# Altium schematic sheet USB-interface.SchDoc: USB-interface
size A4; Engineer: CT; SheetNumber: 2; SheetTotal: 3
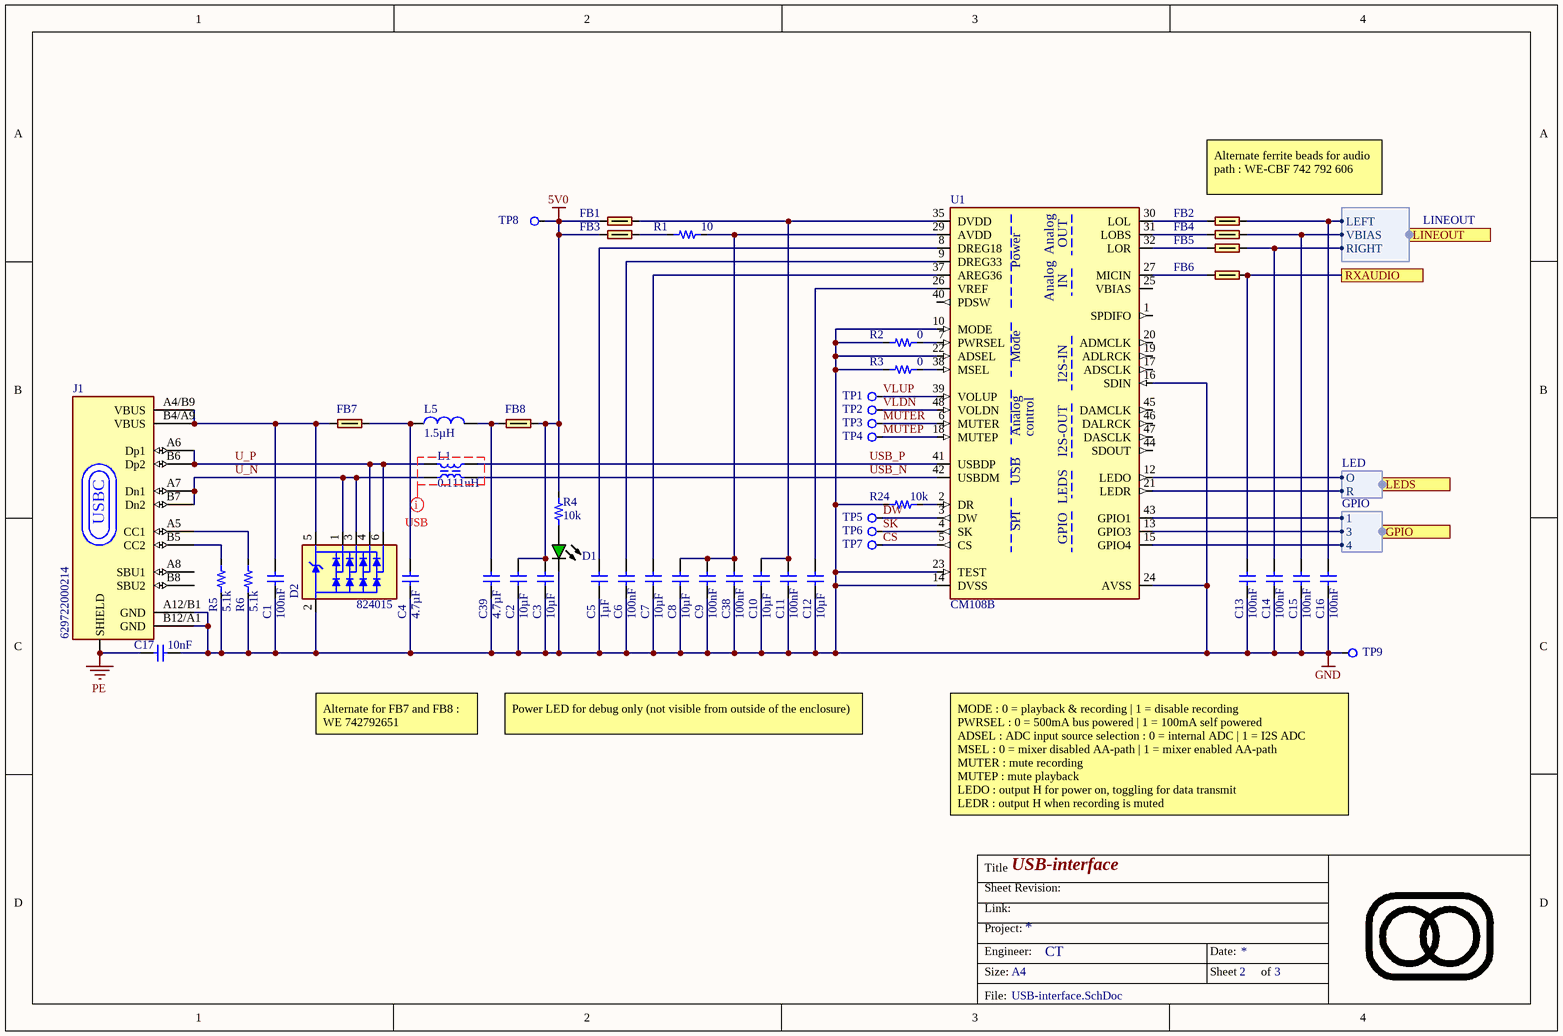
[diagram p0: USB-interface.SchDoc]

## Parts
C1  value 100nF  [0603-C-N]  (hidden comment: alternative Capacitor 100nF +/-10% 50V X7R 0603)
C2  value 10µF  [WCAP-CSGP_1210_L3.2W2.5H2.5]  (hidden comment: Capacitor 10µF +/-10% 50V X7R 1210)
C3  value 10µF  [WCAP-CSGP_1210_L3.2W2.5H2.5]  (hidden comment: Capacitor 10µF +/-10% 50V X7R 1210)
C4  value 4.7µF  [1206-C-N]  (hidden comment: Capacitor 4.7µF +/-10% 10V X7R 1206)
C5  value 1µF  [0603-C-N]  (hidden comment: Capacitor 1µF +/-10% 16V X7R 0603)
C6  value 100nF  [0603-C-N]  (hidden comment: alternative Capacitor 100nF +/-10% 50V X7R 0603)
C7  value 10µF  [WCAP-CSGP_1210_L3.2W2.5H2.5]  (hidden comment: Capacitor 10µF +/-10% 50V X7R 1210)
C8  value 10µF  [WCAP-CSGP_1210_L3.2W2.5H2.5]  (hidden comment: Capacitor 10µF +/-10% 50V X7R 1210)
C9  value 100nF  [0603-C-N]  (hidden comment: alternative Capacitor 100nF +/-10% 50V X7R 0603)
C10  value 10µF  [WCAP-CSGP_1210_L3.2W2.5H2.5]  (hidden comment: Capacitor 10µF +/-10% 50V X7R 1210)
C11  value 100nF  [0603-C-N]  (hidden comment: alternative Capacitor 100nF +/-10% 50V X7R 0603)
C12  value 10µF  [WCAP-CSGP_1210_L3.2W2.5H2.5]  (hidden comment: Capacitor 10µF +/-10% 50V X7R 1210)
C13  value 100nF  [0603-C-N]  (hidden comment: alternative Capacitor 100nF +/-10% 50V X7R 0603)
C14  value 100nF  [0603-C-N]  (hidden comment: alternative Capacitor 100nF +/-10% 50V X7R 0603)
C15  value 100nF  [0603-C-N]  (hidden comment: alternative Capacitor 100nF +/-10% 50V X7R 0603)
C16  value 100nF  [0603-C-N]  (hidden comment: alternative Capacitor 100nF +/-10% 50V X7R 0603)
C17  value 10nF  [0603-C-N]  (hidden comment: Capacitor 10nF 50V NP0 0603)
C38  value 100nF  [0603-C-N]  (hidden comment: alternative Capacitor 100nF +/-10% 50V X7R 0603)
C39  value 4.7µF  [1206-C-N]  (hidden comment: Capacitor 4.7µF +/-10% 10V X7R 1206)
D1  150060GS84000  [WL-SMCW_0603_150060xx8x000]  (value not drawn)
D2  824015  [SOT-23-6]
FB1  742792662  [0603-FB-N]  (value not drawn)
FB2  742792662  [0603-FB-N]  (value not drawn)
FB3  742792662  [0603-FB-N]  (value not drawn)
FB4  742792662  [0603-FB-N]  (value not drawn)
FB5  742792662  [0603-FB-N]  (value not drawn)
FB6  742792662  [0603-FB-N]  (value not drawn)
FB7  74279221111  [WE-CBF_1206_Medium Current]  (value not drawn)
FB8  74279221111  [WE-CBF_1206_Medium Current]  (value not drawn)
J1  629722000214  [629722000214]
L1  Inductance: 0.111uH  [WE-CNSW_1206]  (hidden comment: 744232090)
L5  value 1.5µH  [WE-MAPI_2512]  (hidden comment: 74438324015)
R1  value 10  [0603-R-N]  (hidden comment: Resistor 10R +/-1% 50V 0603)
R2  value 0  [0603-R-N]  (hidden comment: Jumper 0R <50 mOhm 1A 0603)
R3  value 0  [0603-R-N]  (hidden comment: Jumper 0R <50 mOhm 1A 0603)
R4  value 10k  [0603-R-N]  (hidden comment: Resistor 10k +/-1% 50V 0603)
R5  value 5.1k  [0603-R-N]  (hidden comment: Resistor 5.1k +/-1% 50V 0603)
R6  value 5.1k  [0603-R-N]  (hidden comment: Resistor 5.1k +/-1% 50V 0603)
R24  value 10k  [0603-R-N]  (hidden comment: Resistor 10k +/-1% 50V 0603)
TP1  Testpad with multiple sizes  [TP_1.5mm_0.3mmHole]  (value not drawn)  (no BOM)
TP2  Testpad with multiple sizes  [TP_1.5mm_0.3mmHole]  (value not drawn)  (no BOM)
TP3  Testpad with multiple sizes  [TP_1.5mm_0.3mmHole]  (value not drawn)  (no BOM)
TP4  Testpad with multiple sizes  [TP_1.5mm_0.3mmHole]  (value not drawn)  (no BOM)
TP5  Testpad with multiple sizes  [TP_1.5mm_0.3mmHole]  (value not drawn)  (no BOM)
TP6  Testpad with multiple sizes  [TP_1.5mm_0.3mmHole]  (value not drawn)  (no BOM)
TP7  Testpad with multiple sizes  [TP_1.5mm_0.3mmHole]  (value not drawn)  (no BOM)
TP8  Testpad with multiple sizes  [TP_1.5mm_0.3mmHole]  (value not drawn)  (no BOM)
TP9  Testpad with multiple sizes  [TP_1.5mm_0.3mmHole]  (value not drawn)  (no BOM)
U1  CM108B  [TSQFP50P900X900X160-48N]

## Ports
GPIO (harness GPIO), LEDS (harness LED), LINEOUT (harness LINEOUT), RXAUDIO

## Harnesses
LINEOUT: LEFT, VBIAS, RIGHT
LED: O, R
GPIO: 1, 3, 4

## Nets
5V0: C2.2 C3.2 FB1.1 FB3.1 FB8.2 R4.2 TP8.1(Pad)
GND: C1.1 C2.1 C3.1 C4.1 C5.1 C6.1 C7.1 C8.1 C9.1 C10.1 C11.1 C12.1 C13.2 C14.2 C15.2 C16.2 C17.2 C38.1 C39.1 D1.1(K) D2.2 J1.A12/B1(GND) J1.B12/A1(GND) R2.1 R3.1 R5.1 R6.1 R24.2 TP9.1(Pad) U1.10(MODE) U1.14(DVSS) U1.16(SDIN) U1.22(ADSEL) U1.23(TEST) U1.24(AVSS)
PE: C17.1 J1.MNT(SHIELD)
CS: TP7.1(Pad) U1.5(CS)
DW: TP5.1(Pad) U1.3(DW)
MUTEP: TP4.1(Pad) U1.18(MUTEP)
MUTER: TP3.1(Pad) U1.6(MUTER)
RXAUDIO: C13.1 FB6.2 ; port RXAUDIO
SK: TP6.1(Pad) U1.4(SK)
U_N: D2.1 D2.3 J1.A7(Dn1) J1.B7(Dn2) L1.4
U_P: D2.4 D2.6 J1.A6(Dp1) J1.B6(Dp2) L1.1
USB_N: L1.3 U1.42(USBDM)
USB_P: L1.2 U1.41(USBDP)
VLDN: TP2.1(Pad) U1.48(VOLDN)
VLUP: TP1.1(Pad) U1.39(VOLUP)
NetC1_2: C1.2 D2.5 FB7.1 J1.A4/B9(VBUS) J1.B4/A9(VBUS)
NetC4_2: C4.2 FB7.2 L5.1
NetC5_2: C5.2 U1.8(DREG18)
NetC6_2: C6.2 U1.9(DREG33)
NetC7_2: C7.2 U1.37(AREG36)
NetC8_2: C8.2 C9.2 C38.2 R1.2 U1.29(AVDD)
NetC10_2: C10.2 C11.2 FB1.2 U1.35(DVDD)
NetC12_2: C12.2 U1.26(VREF)
NetC14_1: C14.1 FB5.2 ; port LINEOUT.RIGHT
NetC15_1: C15.1 FB4.2 ; port LINEOUT.VBIAS
NetC16_1: C16.1 FB2.2 ; port LINEOUT.LEFT
NetC39_2: C39.2 FB8.1 L5.2
NetD1_2: D1.2(A) R4.1
NetFB2_1: FB2.1 U1.30(LOL)
NetFB3_2: FB3.2 R1.1
NetFB4_1: FB4.1 U1.31(LOBS)
NetFB5_1: FB5.1 U1.32(LOR)
NetFB6_1: FB6.1 U1.27(MICIN)
NetJ1_A5: J1.A5(CC1) R6.2
NetJ1_B5: J1.B5(CC2) R5.2
NetR2_2: R2.2 U1.7(PWRSEL)
NetR3_2: R3.2 U1.38(MSEL)
NetR24_1: R24.1 U1.2(DR)
NetU1_12: U1.12(LEDO) ; port LEDS.O
NetU1_13: U1.13(GPIO3) ; port GPIO.3
NetU1_15: U1.15(GPIO4) ; port GPIO.4
NetU1_21: U1.21(LEDR) ; port LEDS.R
NetU1_43: U1.43(GPIO1) ; port GPIO.1

Not connected (* = marked no-connect by the designer): J1 A8(SBU1) B8(SBU2); U1 1(SPDIFO) 17(ADSCLK) 19(ADLRCK) 20(ADMCLK) 25(VBIAS) 40(PDSW) 44(SDOUT) 45(DAMCLK) 46(DALRCK) 47(DASCLK)

## Layout directives
differential pair: (no net found under the mark)

## Notes on the sheet
- Alternate ferrite beads for audio path : WE-CBF 742 792 606
- Alternate for FB7 and FB8 : WE 742792651
- Power LED for debug only (not visible from outside of the enclosure)
- (near TP9) MODE : 0 = playback & recording | 1 = disable recording
  PWRSEL : 0 = 500mA bus powered | 1 = 100mA self powered
  ADSEL : ADC input source selection : 0 = internal ADC | 1 = I2S ADC
  MSEL : 0 = mixer disabled AA-path | 1 = mixer enabled AA-path
  MUTER : mute recording
  MUTEP : mute playback
  LEDO : output H for power on, toggling for data transmit
  LEDR : output H when recording is muted
- Title
- Sheet Revision:
- Link:
- Size:
- Project:
- Engineer:
- A4
- Date:
- Sheet
- of
- File:
- (in symbol CMP-015-00044-4) OUT; Analog; Power; IN; Mode; I2S-IN; control; I2S-OUT; USB; LEDS; SPI; GPIO
- (in symbol CMP-088-000027-14) USBC

## Library data of the parts
C1 C6 C9 C11 C38 = CMP-072-000619-17: WCAP-CSGP Multilayer Ceramic Chip Capacitor, General Purpose, size 0603, X7R, 100nF, 50VDC; Dissipation Factor: 3%; Tolerance: 10%; Capacitor Type: MLCC; Insulation Resistance: 5GO; Technical Reference: X7R0603104K050DFCT10000; ComponentLink2Description: Datasheet Link; Dielectric: X7R; ComponentLink2URL: https://www.we-online.com/redexpert/spec/885012206095?ad; Case/Package: 0603; Voltage Rating: 50V; Height: 0.8mm; JLCPCB Part #: C14663; Design Item ID: 885012206095; Pins: 2; Min Operating Temperature: -55°C; Max Operating Temperature: 125°C; Width: 0.8mm; ComponentLink1URL: https://www.we-online.com/redexpert/article/885012206095?ad; Match Code: WCAP-CSGP; Packaging: Tape and Reel; Source: WCAP-CSGP.SchLib; Usage: General Purpose; Length: 1.6mm; ComponentLink1Description: Website Link; Mounting Technology: SMT
C2 C3 C7 C8 C10 C12 = CMP-072-000922-16: WCAP-CSGP Multilayer Ceramic Chip Capacitor, General Purpose, size 1210, X7R, 10µF, 50VDC; Tolerance: 10%; Technical Reference: X7R1210106K050DFCT10000; Insulation Resistance: 0.01GO; Capacitor Type: MLCC; ComponentLink2URL: https://www.we-online.com/redexpert/spec/885012209073?ad; ComponentLink1URL: https://www.we-online.com/redexpert/article/885012209073?ad; Source: WCAP-CSGP.SchLib; Case/Package: 1210; Packaging: Tape and Reel; ComponentLink1Description: Website Link; Pins: 2; Width: 2.5mm; Voltage Rating: 50V; ComponentLink2Description: Datasheet Link; Match Code: WCAP-CSGP; Max Operating Temperature: 125°C; Usage: General Purpose; JLCPCB Part #: C77102; Height: 2.5mm; Dielectric: X7R; Dissipation Factor: 10%; Length: 3.2mm; Min Operating Temperature: -55°C; Design Item ID: 885012209073; Mounting Technology: SMT
C4 C39 = CMP-072-000776-16: WCAP-CSGP Multilayer Ceramic Chip Capacitor, General Purpose, size 1206, X7R, 4.7µF, 10VDC; Dissipation Factor: 10%; Capacitor Type: MLCC; Insulation Resistance: 0.02GO; Technical Reference: X7R1206475K010DFCT10000; ComponentLink2Description: Datasheet Link; Dielectric: X7R; ComponentLink2URL: https://www.we-online.com/redexpert/spec/885012208017?ad; Case/Package: 1206; Voltage Rating: 10V; Height: 1.6mm; Tolerance: 10%; Design Item ID: 885012208017; Pins: 2; Min Operating Temperature: -55°C; Max Operating Temperature: 125°C; Width: 1.6mm; ComponentLink1URL: https://www.we-online.com/redexpert/article/885012208017?ad; Match Code: WCAP-CSGP; Packaging: Tape and Reel; Source: WCAP-CSGP.SchLib; Usage: General Purpose; Length: 3.2mm; ComponentLink1Description: Website Link; Mounting Technology: SMT; JLCPCB Basic Part: Yes; JLCPCB Part #: C29823
C5 = CMP-001-00004-22: Capacitor MLCC, General Purpose, size 0603, X7R, 1µF, +/-10%, 16V; Tolerance: 10%; Mounting Technology: SMT; Usage: General Purpose; Case/Package: 0603; Max Operating Temperature: 125°C; JLCPCB Part #: C15849; Dielectric: X7R; RoHS Compliant: True; Height: 0.8mm; Width: 0.8mm; Capacitor Type: MLCC; Voltage Rating: 16V; Length: 1.6mm; Pins: 2; Min Operating Temperature: -55°C
C13-C16 = CMP-072-000619-17: WCAP-CSGP Multilayer Ceramic Chip Capacitor, General Purpose, size 0603, X7R, 100nF, 50VDC; Tolerance: 10%; Dissipation Factor: 3%; Capacitor Type: MLCC; Insulation Resistance: 5GO; Technical Reference: X7R0603104K050DFCT10000; Case/Package: 0603; Width: 0.8mm; Min Operating Temperature: -55°C; Mounting Technology: SMT; Dielectric: X7R; Packaging: Tape and Reel; Max Operating Temperature: 125°C; Voltage Rating: 50V; Height: 0.8mm; Length: 1.6mm; JLCPCB Part #: C14663; ComponentLink2Description: Datasheet Link; ComponentLink2URL: https://www.we-online.com/redexpert/spec/885012206095?ad; Design Item ID: 885012206095; Pins: 2; ComponentLink1URL: https://www.we-online.com/redexpert/article/885012206095?ad; Match Code: WCAP-CSGP; Source: WCAP-CSGP.SchLib; Usage: General Purpose; ComponentLink1Description: Website Link
C17 = CMP-001-00137-7: Multilayer Ceramic Capacitor, Grm Series, 0.01 F, 5%, C0g / Np0, 50 V, 0603 [1608 Metric]; FLIR Part #: YCAM10N-7; Page Part #: CCQJ103T; Temperature Coefficient: 30ppm/°C; Reach SVHC Compliant: No; Case/Package: 0603; Thickness: 0.035inch; Width: 0.8mm; Case Code (Metric): 1608; Termination: SMD/SMT; Min Operating Temperature: -55°C; Voltage Rating (DC): 50V; Mounting Technology: Surface Mount; Package Quantity: 4000; Depth: 0.8mm; Dielectric: C0G; Packaging: Cut Tape; Voltage: 50V; Max Operating Temperature: 125°C; RoHS Compliant: Yes; Material: Ceramic; Lead Pitch: 0.5mm; Case Code (Imperial): 0603; Tolerance: 5%; Voltage Rating: 50V; Lead Free: Lead Free; Height: 0.8mm; Length: 1.6mm; JLCPCB Part #: C85973; Series: GRM
D1 = CMP-002-001076-16: WL-SMCW Mono-color Chip LED Waterclear, size 0603, Green, 3.3V, 40°; Manufacturer: Wurth Elektronik; Page Part #: MOVPA-0270A; Chip Technology: InGaN; Case/Size Code: 0603; Luminous Intensity: 3000mcd; Peak Wavelength: 520nm; Dominant Wavelength: 525nm; Mount: Surface Mount; Design Item ID: 150060GS84000; Category: Signal LEDs; Component Type: Standard; Emitting Color: Green; Viewing Angle: 40°; Height: 0.95mm; Width: 0.8mm; Length: 1.6mm; JLCPCB Part #: C7429914; Packaging: Tape and Reel; Match Code: WL-SMCW; ComponentLink2Description: Datasheet Link; Forward Voltage: 3.3V; ComponentLink1Description: Website Link; ComponentLink2URL: https://www.we-online.com/redexpert/spec/150060GS84000?ad; Source: WL-SMCW.SchLib; Operating Temperature Max: 85°C; Manufacturer Part Number: 150060GS84000; Pin Count: 2; Operating Temperature Min: -40°C; ComponentLink1URL: https://www.we-online.com/redexpert/article/150060GS84000?ad
D2 = CMP-034-000015-16: WE-TVS TVS Diode - High Speed Series, SOT23-6L, 4+1Channel, 5Vdc; FLIR Part #: YDITA20KV100A; Manufacturer Part Number: SP3051; Manufacturer: Wurth Elektronik; Page Part #: D824015; Reverse Channel Leakage Current: 2uA; Reverse Breakdown Voltage min.: 6.1V; Reverse Peak Pulse Current: 12A; Channel: 4+1; DC Operating Voltage: 5V; Channel Input Capacitance: 2pF; Pin Count: 6; Packaging: Tape and Reel; Source: WE-TVS.SchLib; ComponentLink1Description: Manufacturer; ComponentLink2Description: Datasheet; Mounting Technology: SMT; JLCPCB Part #: C558418; Operating Temperature: -40 to +125degC; Published Date: April 2020; Size: SOT23-6L; ComponentLink2URL: https://www.we-online.com/catalog/datasheet/824015.pdf; Design Item ID: 824015; Component Type: Standard; ComponentLink1URL: http://www.we-online.de
FB1-FB6 = CMP-066-000126-8: WE-CBF SMT EMI Suppression Ferrite Bead, size 0603, 1000O, 0.83A; Manufacturer: Wurth Elektronik; Page Part #: FILTER279; Case/Size Code: 0603; Impedance Max Test Condition: 120MHz; Type: Wide Band; DC Resistance Max: 0.3O; Impedance Max: 1050O; Rated Current: 0.6A; Mount: Surface Mount; Impedance @100MHz: 1000O; JLCPCB Part #: C180490; ComponentLink1URL: https://www.we-online.com/redexpert/article/742792662?ad; ComponentLink2URL: https://www.we-online.com/redexpert/spec/742792662?ad; Length: 1.6mm; ComponentLink1Description: Website Link; Manufacturer Part Number: 742792662; Width: 0.8mm; Match Code: WE-CBF; Component Type: Standard; Design Item ID: 742792662; Pin Count: 2; Operating Temperature Max: 125°C; Packaging: Tape and Reel; ComponentLink2Description: Datasheet Link; Operating Temperature Min: -55°C; Category: Ferrites for PCB Assembly; Height: 0.8mm
FB7 FB8 = CMP-006-00032-6: Ferrite Beads Multi-Layer High Current 110Ohm 25% 100MHz 5.4A 0.015Ohm DCR 1206 T/R; Manufacturer: Wurth Elektronik; Impedance @100MHz: 120O; Case/Size Code: 1206; Impedance Max Test Condition: 500MHz; Match Code: WE-CBF; DC Resistance Max: 0.03O; Impedance Max: 180O; Rated Current: 3A; Mount: Surface Mount; JLCPCB Part #: C85841; ComponentLink1URL: https://www.we-online.com/redexpert/article/742792113?ad; ComponentLink2URL: https://www.we-online.com/redexpert/spec/742792113?ad; Length: 0.126inch; Type: High Current; ComponentLink1Description: Website Link; Width: 1.6mm; Component Type: Standard; Pin Count: 2; Operating Temperature Max: 125°C; Packaging: Tape and Reel; ComponentLink2Description: Datasheet Link; Operating Temperature Min: -55°C; Category: Ferrites for PCB Assembly; Height: 0.051inch; Source: WE-CBF.SchLib
J1 = CMP-088-000027-14: WR-USB 2.0 Type C, Receptacle, Horizontal, SMT; pin to pad: MNT>S1+S2+S3+S4; Manufacturer: Wurth Elektronik; Page Part #: K629722000214; Number of Ports: 1; Working Voltage: 20VAC; Interface Type: Type C; Rated Current: 5A; Category: Input/Output Connectors; ComponentLink1Description: Website Link; Orientation: Horizontal; ComponentLink1URL: https://www.we-online.com/redexpert/article/629722000214?ad; Pin Count: 13; Manufacturer Part Number: 629722000214; ComponentLink2Description: Datasheet Link; Gender: Receptacle; Match Code: WR-USB; Operating Temperature Min: -40°C; Source: WR-USB.SchLib; Number of Pins: 16; Operating Temperature Max: 85°C; Application: USB 2.0; Packaging: Tape and Reel; Mount: Surface Mount; Component Type: Standard; Design Item ID: 629722000214; ComponentLink2URL: https://www.we-online.com/redexpert/spec/629722000214?ad; JLCPCB Part #: C2982555
L1 = CMP-061-000012-8: WE-CNSW SMT Common Mode Line Filter, size 1206, 90Ohm, 0.111uH, 50V; DC Resistance Max: 0.3Ohm; Insulation Test Voltage: 125VAC; Winding Style: bifiliar; Rated Current: 0.37A; Case/Size Code: 1206; Match Code: WE-CNSW; Design Item ID: 744232090; Mount: Surface Mount; Component Type: Standard; Length: 3.2mm; ComponentLink1Description: Manufacturer Link; Packaging: Tape and Reel; ComponentLink2URL: https://www.we-online.com/redexpert/spec/744232090?ad; Operating Temperature Min: -40°C; Operating Temperature Max: 125°C; Width: 1.6mm; ComponentLink2Description: Datasheet; Category: Common Mode Chokes; JLCPCB Part #: C131487; Source: WE-CNSW.SchLib; Impedance @100MHz: 90Ohm; ComponentLink1URL: https://www.we-online.com/redexpert/article/744232090?ad; Height: 1.8mm; Pin Count: 4; Rated Voltage: 50V
L5 = CMP-002-001574-1: Inductor Power Shielded Wirewound 1.5uH 20% 100KHz Powdered Iron 2.2A 99mOhm DCR 1008 T/R; Saturation Current: 3.7A; Core Material: Composite, Ferrite, Metal; DC Resistance (DCR): 82mΩ; Self Resonant Frequency: 60MHz; Height: 1.2mm; Shielding: Shielded; Width: 2mm; Case Code (Imperial): 1008; Max Operating Temperature: 125°C; Test Frequency: 100kHz; Max DC Current: 2.2A; Case/Package: 1008; Inductance Tolerance: 20%; RoHS: Compliant; Height - Seated (Max): 1.1938mm; Pins: 2; Termination: SMD/SMT; Tolerance: 20%; JLCPCB Part #: C161084; Case Code (Metric): 2520; RMS Current (Irms): 2.2A; Current Rating: 2.2A; Ambient Temperature Range High: 85°C; Min Operating Temperature: -40°C; REACH SVHC: Unknown; Weight: 32.006612mg; Ambient Temperature Range Low: -40°C; Mounting Technology: Surface Mount; Length: 2.5mm
R1 = CMP-009-00230-19: Chip Resistor, Thick Film, General Purpose, 0603, 100mW, 50V, 10 Ohm, +/-1%; Page Part #: ROQF1009; Tolerance: 1%; Elements: 1; Temperature Coefficient: 200ppm/°C; Pins: 2; Max Operating Temperature: 155°C; Mounting Technology: SMT; RoHS Compliant: Yes; JLCPCB Part #: C22859; Voltage Rating: 50V; Case/Package: 0603; Resistor Type: Thick Film; Min Operating Temperature: -55°C; Power Rating: 100mW; Usage: General Purpose
R2 R3 = CMP-009-00006-27: Chip Jumper, Thick Film, Jumper, 0603, 100mW, 1A, 0 Ohm, <50 mOhm; FLIR Part #: YRES0E-1; Page Part #: ROQJ0000; Elements: 1; Tolerance: 50 mOhm; Voltage Rating: 75V; Min Operating Temperature: -55°C; RoHS Compliant: True; Usage: Jumper; Mounting Technology: SMT; Max Operating Temperature: 155°C; Case/Package: 0603; JLCPCB Part #: C21189; Current Rating: 1A; Resistor Type: Thick Film; Power Rating: 100mW; Pins: 2; JLCPCB Basic Part: Yes
R4 R24 = CMP-009-00017-29: Chip Resistor, Thick Film, General Purpose, 0603, 100mW, 50V, 10 kOhm, +/-1%; FLIR Part #: YRES10K-1; Page Part #: ROQF1002; Elements: 1; Tolerance: 1%; Pins: 2; Resistor Type: Thick Film; Voltage Rating: 50V; Power Rating: 100mW; Mounting Technology: SMT; Min Operating Temperature: -55°C; Case/Package: 0603; RoHS Compliant: Yes; Usage: General Purpose; JLCPCB Part #: C25804; Max Operating Temperature: 155°C; JLCPCB Basic part: Yes
R5 R6 = CMP-009-00192-22: Chip Resistor, Thick Film, General Purpose, 0603, 100mW, 50V, 5.1 kOhm, +/-1%; Page Part #: ROQF5101; Elements: 1; Tolerance: 1%; Temperature Coefficient: 100ppm/°C; Power Rating: 100mW; Voltage Rating: 50V; Pins: 2; Case/Package: 0603; Usage: General Purpose; Mounting Technology: SMT; JLCPCB Part #: C23186; REACH SVHC: No SVHC; Min Operating Temperature: -55°C; Resistor Type: Thick Film; Max Operating Temperature: 155°C
TP1-TP9 = CMP-027-000000-20: Testpad land; Design Item ID: Testpad; Component Type: Standard; Pin Count: 1
U1 = CMP-015-00044-4: USB Audio Codec improved on CM108AH with crystal-less design; pin to pad: 14>14+36 24>24+33 29>29+34; JLCPCB Part #: C371347